# EAGLE design miniterm (EAGLE 5.10)
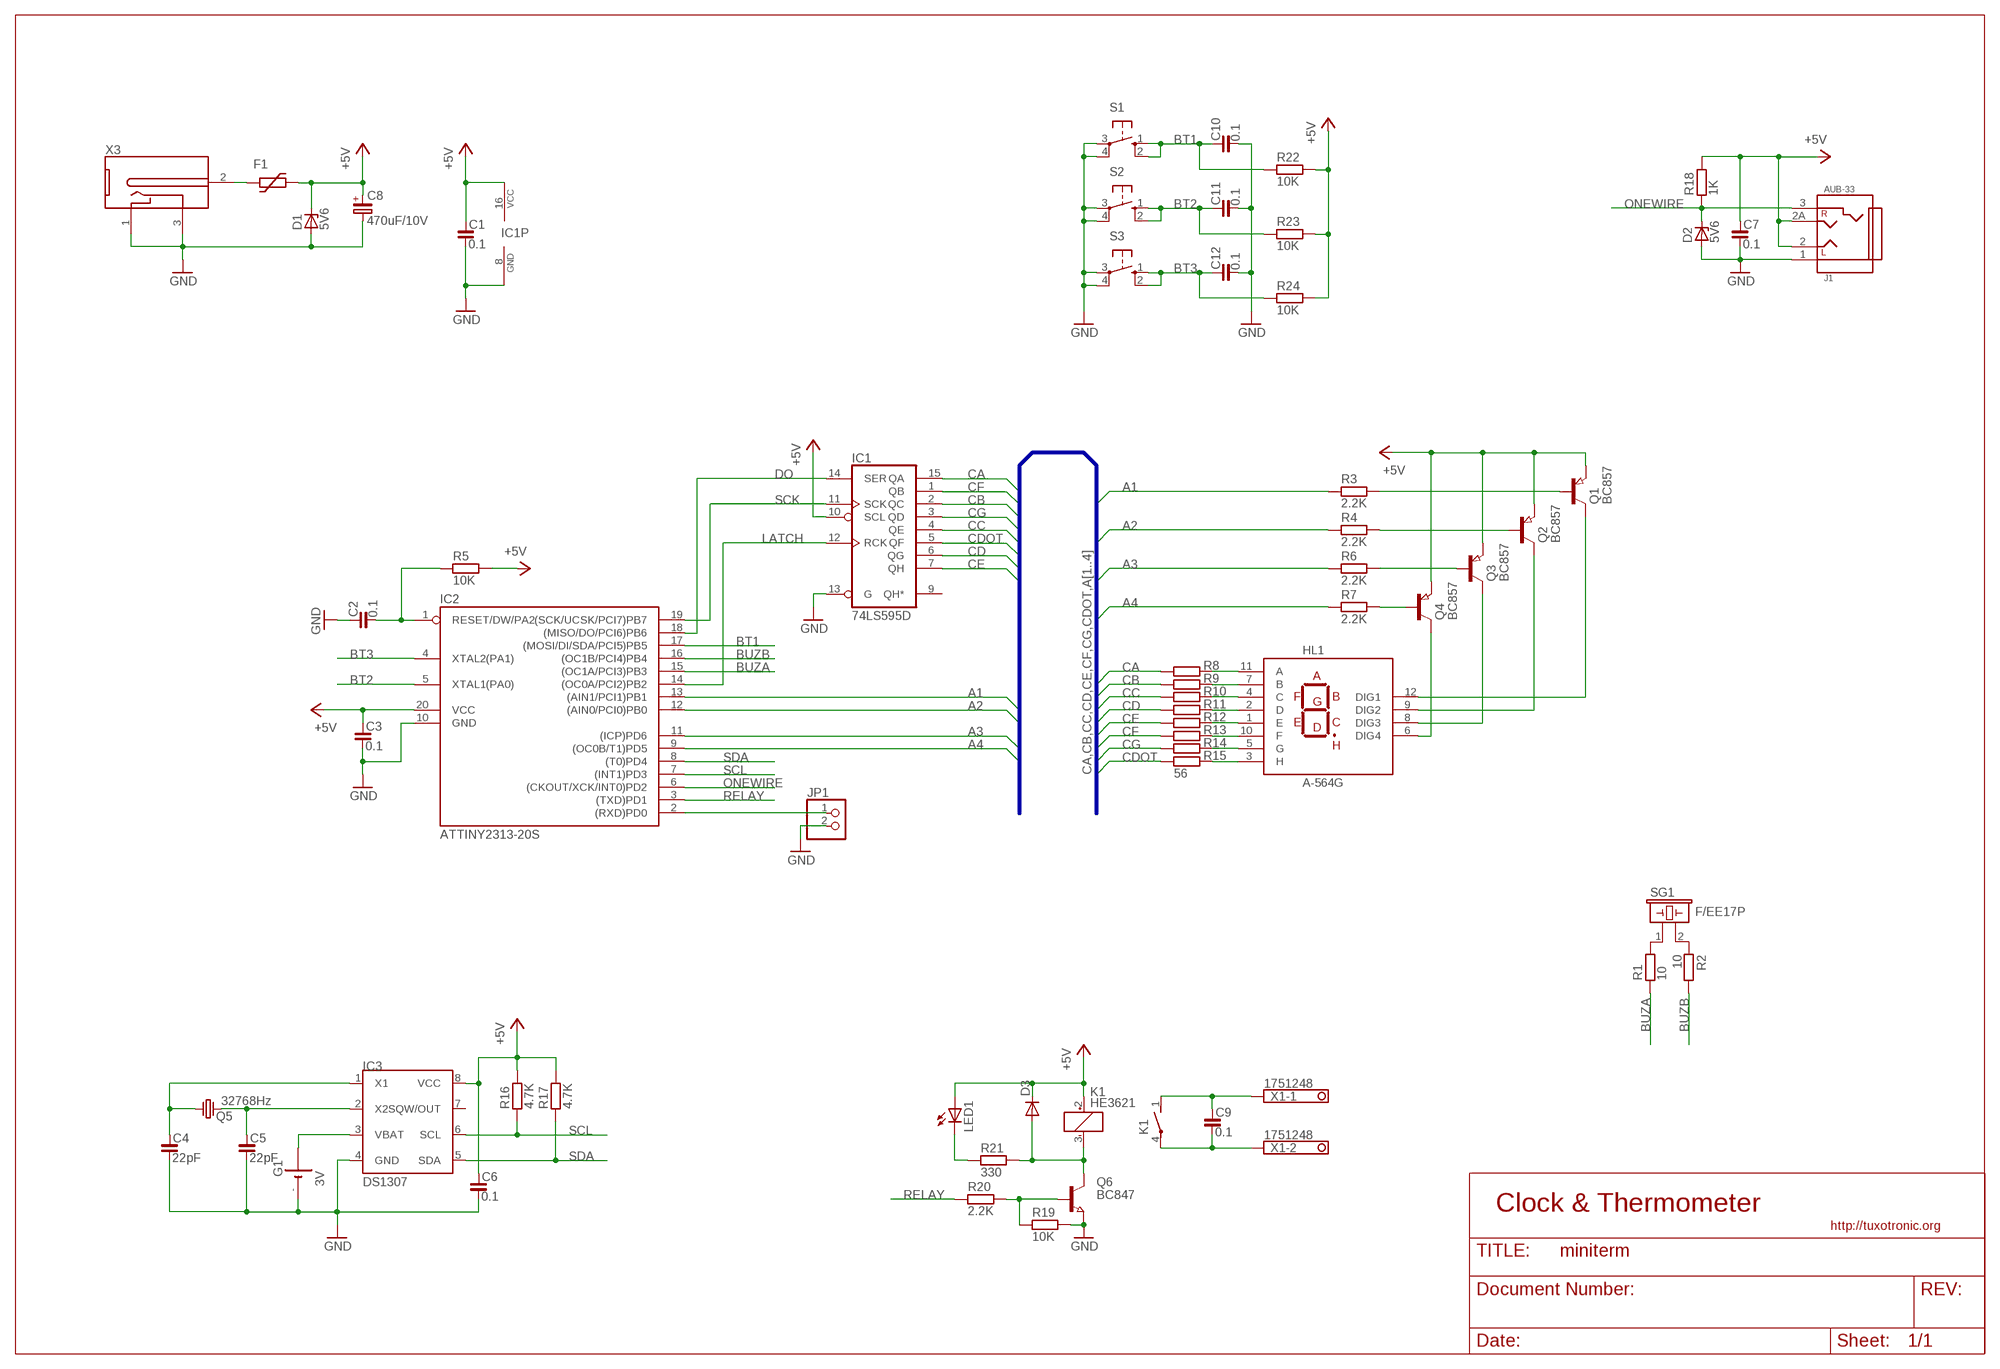
[diagram p0: schematic, sheet 1]

## Parts
C1  0.1  C_0805  [C0805]
C2  0.1  C_0805  [C0805]
C3  0.1  C_0805  [C0805]
C4  22pF  C_0805  [C0805]
C5  22pF  C_0805  [C0805]
C6  0.1  C_0805  [C0805]
C7  0.1  C_0805  [C0805]
C8  470uF/10V  CP_E-035X080  [CE-035X080]
C9  0.1  C_1206  [C1206]
C10  0.1  C_0805  [C0805]
C11  0.1  C_0805  [C0805]
C12  0.1  C_0805  [C0805]
D1  5V6  ZENER-SOD80C  [SOD80C]
D2  5V6  ZENER-SOD80C  [SOD80C]
D3  DIODE-SOD80C  [SOD80C]
F1  1812L  [1812L]
G1  3V  LI3VHOLDER  [LITHOLDER]
HL1  A-564G  [C/A-564]
IC1  74LS595D  [SO16]
IC2  ATTINY2313-20S  [SO20L]
IC3  DS1307  [SOIC-8]
J1  AUB-33  [AUB-33]
JP1  PINHD-1X2_2.54  [1X02]
K1  HE3621  [HE3621]
LED1  LED3MM  [LED3MM]
Q1  BC857  PNP-TRANSISTOR_SOT23  [SOT23]
Q2  BC857  PNP-TRANSISTOR_SOT23  [SOT23]
Q3  BC857  PNP-TRANSISTOR_SOT23  [SOT23]
Q4  BC857  PNP-TRANSISTOR_SOT23  [SOT23]
Q5  32768Hz  CRYSTAL-TC38H  [TC38H]
Q6  BC847  NPN-TRANSISTOR_SOT23  [SOT23]
R1  10  R_0805  [R0805]
R2  10  R_0805  [R0805]
R3  2.2K  R_0805  [R0805]
R4  2.2K  R_0805  [R0805]
R5  10K  R_0805  [R0805]
R6  2.2K  R_0805  [R0805]
R7  2.2K  R_0805  [R0805]
R8  56  R_0805  [R0805]
R9  56  R_0805  [R0805]
R10  56  R_0805  [R0805]
R11  56  R_0805  [R0805]
R12  56  R_0805  [R0805]
R13  56  R_0805  [R0805]
R14  56  R_0805  [R0805]
R15  56  R_0805  [R0805]
R16  4.7K  R_0805  [R0805]
R17  4.7K  R_0805  [R0805]
R18  1K  R_0805  [R0805]
R19  10K  R_0805  [R0805]
R20  2.2K  R_0805  [R0805]
R21  330  R_0805  [R0805]
R22  10K  R_0805  [R0805]
R23  10K  R_0805  [R0805]
R24  10K  R_0805  [R0805]
S1  10-XX  [B3F-10XX]
S2  10-XX  [B3F-10XX]
S3  10-XX  [B3F-10XX]
SG1  F/EE17P  [F/EE17P]
X1  1751248  [1751248]
X3  DC-2.1MM-5MM  [DC-21MM]

## Nets
+5V: C1.1 C3.1 C6.1 C7.1 C8.+ D1.C D3.C F1.P$2 IC1.10(SCL) IC1.16(VCC) IC2.20(VCC) IC3.8(VCC) J1.2 J1.2A K1.2(1:+) LED1.A Q1.2(E) Q2.2(E) Q3.2(E) Q4.2(E) R5.2 R16.2 R17.2 R18.2 R22.2 R23.2 R24.2
A1: IC2.13((AIN1/PCI1)PB1) R3.1
A2: IC2.12((AIN0/PCI0)PB0) R4.1
A3: IC2.11((ICP)PD6) R6.1
A4: IC2.9((OC0B/T1)PD5) R7.1
BT1: C10.1 IC2.17((MOSI/DI/SDA/PCI5)PB5) R22.1 S1.1(S) S1.2(S1)
BT2: C11.1 IC2.5(XTAL1(PA0)) R23.1 S2.1(S) S2.2(S1)
BT3: C12.1 IC2.4(XTAL2(PA1)) R24.1 S3.1(S) S3.2(S1)
BUZA: IC2.15((OC1A/PCI3)PB3) R1.1
BUZB: IC2.16((OC1B/PCI4)PB4) R2.2
CA: IC1.15(QA) R8.1
CB: IC1.2(QC) R9.1
CC: IC1.4(QE) R10.1
CD: IC1.6(QG) R11.1
CDOT: IC1.5(QF) R15.1
CE: IC1.7(QH) R12.1
CF: IC1.1(QB) R13.1
CG: IC1.3(QD) R14.1
DO: IC1.14(SER) IC2.18((MISO/DO/PCI6)PB6)
GND: C1.2 C2.1 C3.2 C4.2 C5.2 C6.2 C7.2 C8.- C10.2 C11.2 C12.2 D1.A D2.A G1.- IC1.8(GND) IC1.13(G) IC2.10(GND) IC3.4(GND) J1.1 JP1.2 Q6.2(E) R19.2 S1.3(P) S1.4(P1) S2.3(P) S2.4(P1) S3.3(P) S3.4(P1) X3.1 X3.3
LATCH: IC1.12(RCK) IC2.14((OC0A/PCI2)PB2)
N$2: HL1.11(A) R8.2
N$3: HL1.7(B) R9.2
N$4: HL1.4(C) R10.2
N$5: HL1.2(D) R11.2
N$6: HL1.1(E) R12.2
N$7: HL1.10(F) R13.2
N$8: HL1.5(G) R14.2
N$9: HL1.3(H) R15.2
N$10: Q1.1(B) R3.2
N$11: Q2.1(B) R4.2
N$12: Q3.1(B) R6.2
N$13: Q4.1(B) R7.2
N$14: HL1.12(DIG1) Q1.3(C)
N$15: HL1.9(DIG2) Q2.3(C)
N$16: HL1.8(DIG3) Q3.3(C)
N$17: HL1.6(DIG4) Q4.3(C)
N$18: R1.2 SG1.1
N$19: R2.1 SG1.2
N$20: C5.1 IC3.2(X2) Q5.2
N$21: C2.2 IC2.1(RESET/DW/PA2) R5.1
N$22: C4.1 IC3.1(X1) Q5.1
N$23: F1.P$1 X3.2
N$24: D3.A K1.3(1:-) Q6.3(C) R21.2
N$25: G1.+ IC3.3(VBAT)
N$26: LED1.K(C) R21.1
N$27: Q6.1(B) R19.1 R20.2
N$28: C9.1 K1.1(2:S) X1.1
N$29: C9.2 K1.4(2:P) X1.2
N$30: IC2.2((RXD)PD0) JP1.1
ONEWIRE: D2.C IC2.6((CKOUT/XCK/INT0)PD2) J1.3 R18.1
RELAY: IC2.3((TXD)PD1) R20.1
SCK: IC1.11(SCK) IC2.19((SCK/UCSK/PCI7)PB7)
SCL: IC2.7((INT1)PD3) IC3.6(SCL) R16.1
SDA: IC2.8((T0)PD4) IC3.5(SDA) R17.1
Unconnected: IC1.9(QH*) IC3.7(SQW/OUT)

## Buses
CA,CB,CC,CD,CE,CF,CG,CDOT,A[1..4]

## Notes on the sheet
- Clock & Thermometer

## Library data of the parts
C1-C7 C9-C12 = rc-master-smd:C_: NON-POLARIZED CAP
C8 = rc-master:CP_: POLARIZED CAP
D1 D2 = discrete:ZENER-: Z-Diode
D3 = discrete:DIODE-: DIODE
F1 = discrete:1812L
G1 = battery:LI3VHOLDER
HL1 = led-seg:A-564: Para Light A-564x Four digits 7seg display Common anode. 50x19 mm place. 14.22mm (560 mil) digit height CA56-21GWA compatible 2009 Draw by Ivan A-R <http://tuxotronic.org>. License CC-BY-SA 3.0 <http://creativecommons.org/licenses/by-sa/3.0/>
IC1 = 74xx-us:74*595: 8-bit SHIFT REGISTER, output latch
IC2 = avr:ATTINY2313: MICROCONTROLLER 2 Kbytes FLASH 128 bytes SRAM 128 bytes EEPROM USART USI
IC3 = dallas-1:DS1307: I2C Serial RTC w/56 bytes battery backed RAM
J1 = connectors:AUB-33
JP1 = pinhead-fixdrills:PINHD-1X2: PIN HEADER
K1 = myrelays:HE3621: RELAY reed, 1 x norm. open, grid 5.08 mm, Hamlin
LED1 = led:LED: LED OSRAM: - CHIPLED LG R971, LG N971, LY N971, LG Q971, LY Q971, LO R971, LY R971 LH N974, LH R974 LS Q976, LO Q976, LY Q976 LO Q996 - Hyper CHIPLED LW Q18S LB Q993, LB Q99A, LB R99A - SideLED LS A670, LO A670, LY A670, LG A670, LP A670 LB A673, LV A673, LT A673, LW A673 LH A674 LY A675 LS A676, LA A676, LO A676, LY A676, LW A676 LS A679, LY A679, LG A679 - Hyper Micro SIDELED® LS Y876, LA Y876, LO Y876, LY Y876 LT Y87S - SmartLED LW L88C, LW L88S LB L89C, LB L89S, LG L890 LS L89K, LO L89K, LY L89K LS L896, LA L896, LO L896, LY L896 - TOPLED LS T670, LO T670, LY T670, LG T670, LP T670 LSG T670, LSP T670, LSY T670, LOP T670, LYG T670 LG T671, LOG T671, LSG T671 LB T673, LV T673, LT T673, LW T673 LH T674 LS T676, LA T676, LO T676, LY T676, LB T676, LH T676, LSB T676, LW T676 LB T67C, LV T67C, LT T67C, LS T67K, LO T67K, LY T67K, LW E67C LS E67B, LA E67B, LO E67B, LY E67B, LB E67C, LV E67C, LT E67C LW T67C LS T679, LY T679, LG T679 LS T770, LO T770, LY T770, LG T770, LP T770 LB T773, LV T773, LT T773, LW T773 LH T774 LS E675, LA E675, LY E675, LS T675 LS T776, LA T776, LO T776, LY T776, LB T776 LHGB T686 LT T68C, LB T68C - Hyper Mini TOPLED® LB M676 - Mini TOPLED Santana® LG M470 LS M47K, LO M47K, LY M47K Source: http://www.osram.convergy.de - LUMILED® LXK2-PW12-R00, LXK2-PW12-S00, LXK2-PW14-U00, LXK2-PW14-V00 LXK2-PM12-R00, LXK2-PM12-S00, LXK2-PM14-U00 LXK2-PE12-Q00, LXK2-PE12-R00, LXK2-PE12-S00, LXK2-PE14-T00, LXK2-PE14-U00 LXK2-PB12-K00, LXK2-PB12-L00, LXK2-PB12-M00, LXK2-PB14-N00, LXK2-PB14-P00, LXK2-PB14-Q00 LXK2-PR12-L00, LXK2-PR12-M00, LXK2-PR14-Q00, LXK2-PR14-R00 LXK2-PD12-Q00, LXK2-PD12-R00, LXK2-PD12-S00 LXK2-PH12-R00, LXK2-PH12-S00 LXK2-PL12-P00, LXK2-PL12-Q00, LXK2-PL12-R00 Source: www.luxeon.com
Q1-Q4 = semicon-smd-ipc:PNP-TRANSISTOR_: PNP TRANSISTOR
Q5 = crystal:CRYSTAL-: CRYSTAL
Q6 = semicon-smd-ipc:NPN-TRANSISTOR_: NPN TRANSISTOR
R1-R24 = rc-master-smd:R_: RESISTOR
S1-S3 = buttons:10-XX: OMRON SWITCH
SG1 = buzzer:F/EE17P: BUZZER Source: Buerklin
X1 = con-phoenix-350:1751248: MKDS 1/ 2-3,5 Printklemme Nennstrom: 10 A Bemessungsspannung: 160 V Raster: 3,5 mm Polzahl: 2 Montageart: Löten Anschlussart: Schraubanschluss Anschlussrichtung vom Leiter zur Platine: 0° Source: http://eshop.phoenixcontact.com .. 1751248.pdf
X3 = power-jack:DC: 5mm x 2.1mm jack

## Board
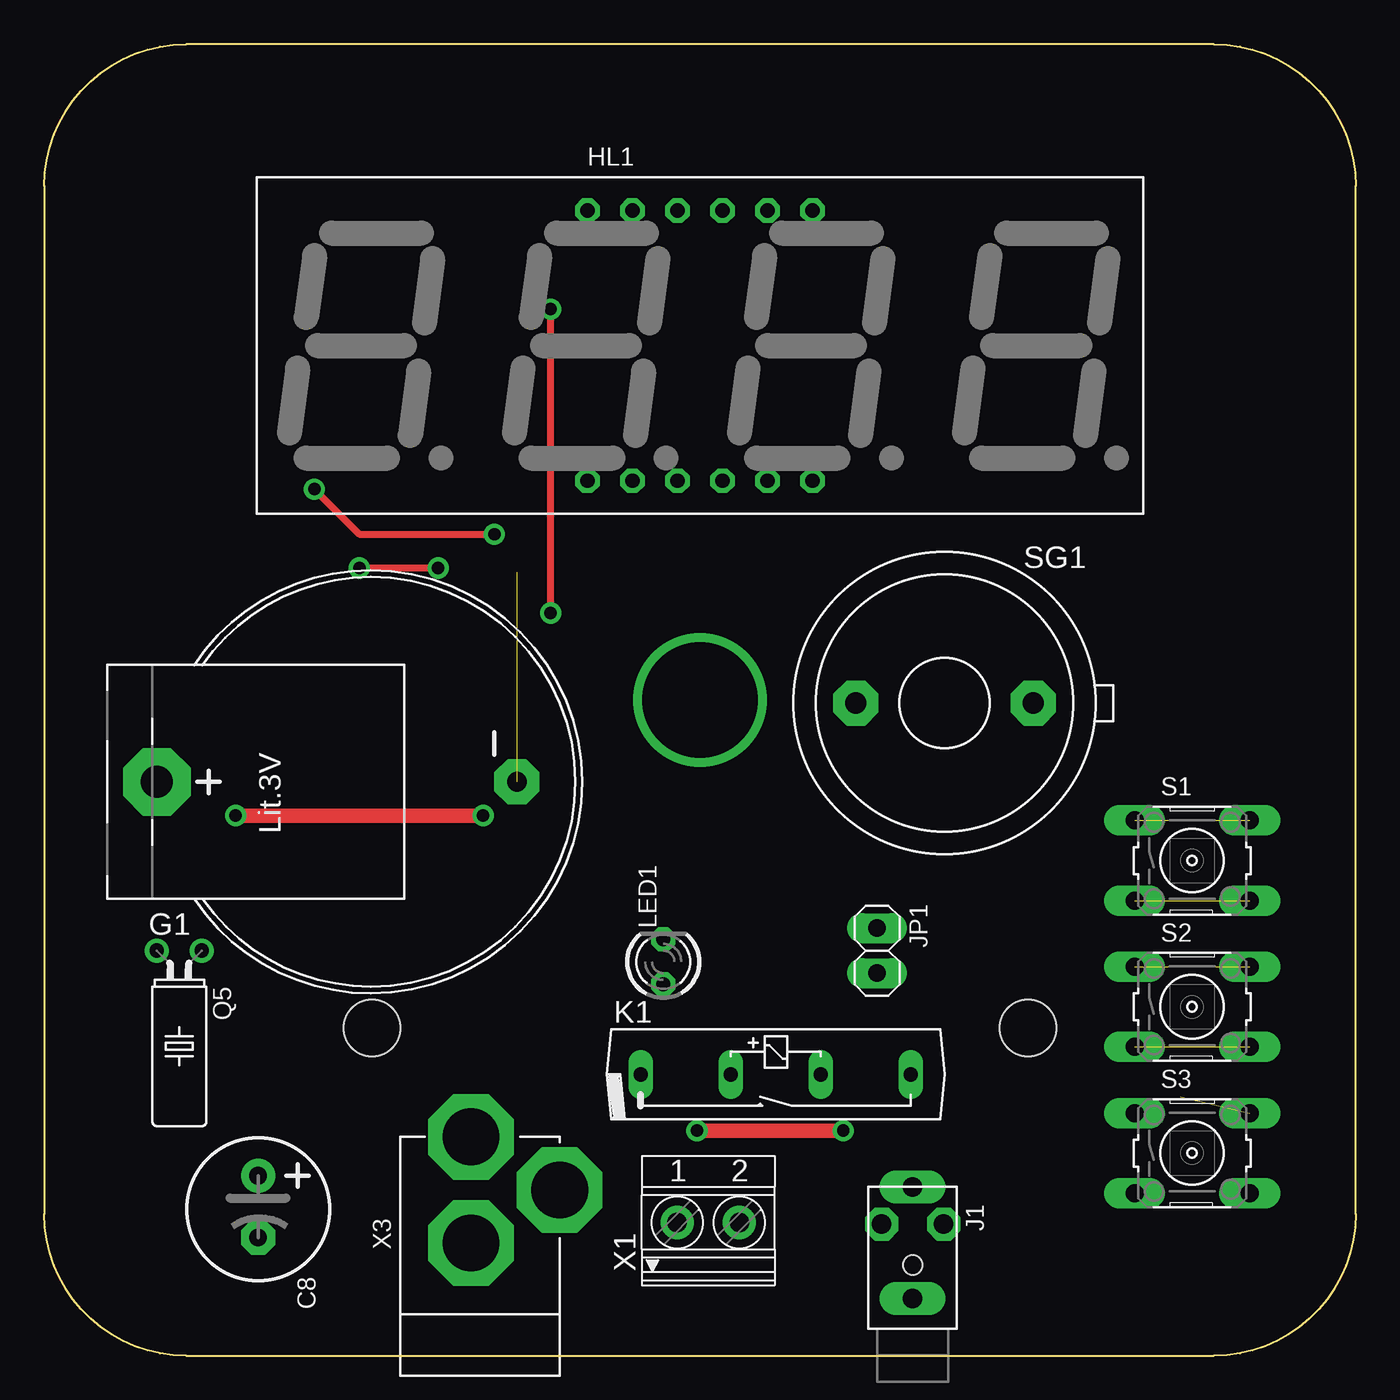
[diagram p1: board, top side]
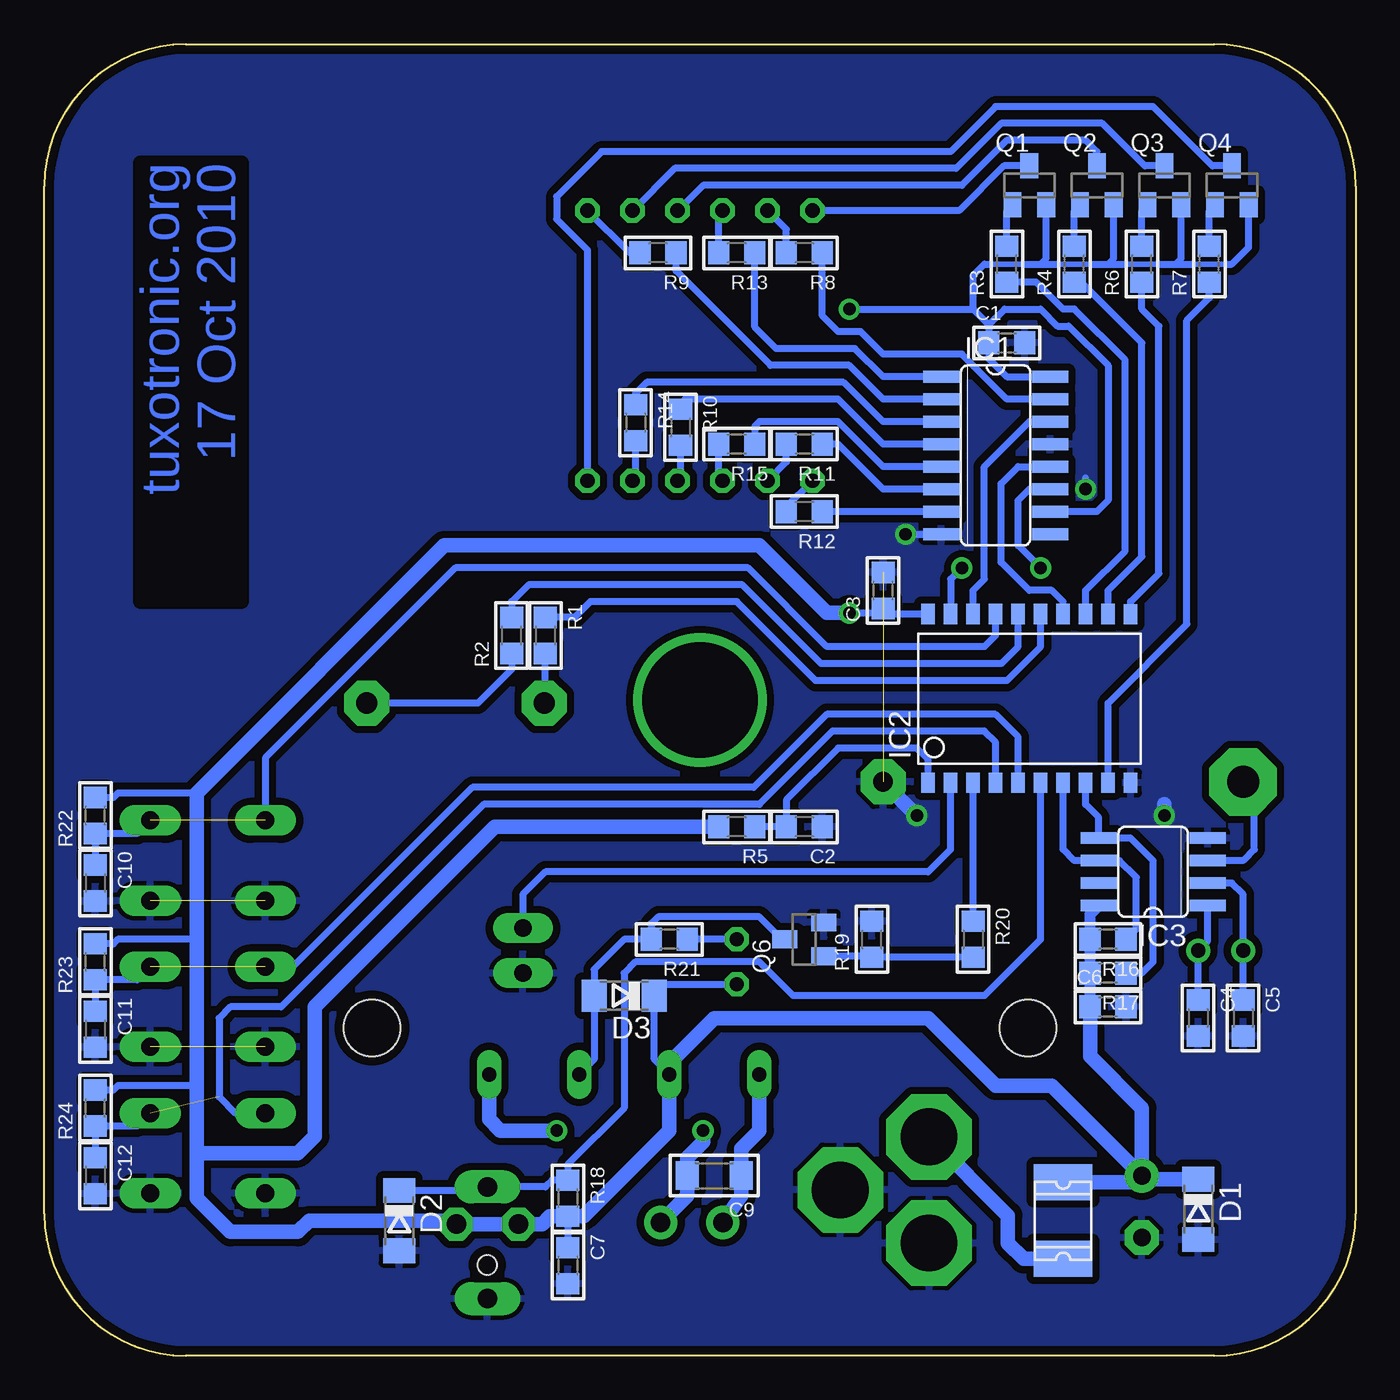
[diagram p2: board, bottom side, seen from below]

Size 74 x 74 mm. Coordinates in mm from the lower left corner, seen from the top.
Outline: 8,0 66,0 arc90 74,8 74,66 arc90 66,74 8,74 arc90 0,66 0,8 arc90 8,0
Copper layers (1*16): Top 0.035mm / dielectric 1.5mm / Bottom 0.035mm
Design rules "default *": minimum track width 10mil, minimum drill 24mil, track to track 10mil, track to pad 10mil, pad to pad 10mil, via to via 10mil, smd to smd 10mil, copper to edge 0.5mm, drill to drill 8mil, minimum pad ring 10mil, minimum via ring 8mil, stop-mask expansion 4mil, vias tented up to drill 0mil, thermal gap 10mil
Holes 3.2 mm at 18.5,18.5 55.5,18.5
bRestrict: area 62.9,42.5 to 68.6,67.3

### Footprints (pad centres in the part's own frame; a part is rotated, then mirrored left to right if it is on the bottom)
C0805 = smd 1.2 x 1.3: 1 -1.016,0; 2 1.016,0
CE-035X080 = drill 1 pad 1.93 round: + -1.905,0 | drill 1 pad 1.93 octagon: - 1.587,0
C1206 = smd 1.3 x 1.6: 1 -1.524,0; 2 1.524,0
SOD80C = smd 1.4 x 1.8: A 1.7,0; C -1.7,0
1812L = smd 2.03 x 3.3: P$1 -2.16,0; P$2 2.16,0
LITHOLDER = drill 1.803 pad 3.81 octagon: + 0,12.065 | drill 1.118 pad 2.54 octagon: - 0,-8.255
C/A-564 = drill 0.8 octagon: 1 -6.35,-7.62; 2 -3.81,-7.62; 3 -1.27,-7.62; 4 1.27,-7.62; 5 3.81,-7.62; 6 6.35,-7.62; 7 6.35,7.62; 8 3.81,7.62; 9 1.27,7.62; 10 -1.27,7.62; 11 -3.81,7.62; 12 -6.35,7.62
SO16 = smd 0.66 x 2.032: 1 -4.445,-3.073; 2 -3.175,-3.073; 3 -1.905,-3.073; 4 -0.635,-3.073; 5 0.635,-3.073; 6 1.905,-3.073; 7 3.175,-3.073; 8 4.445,-3.073; 9 4.445,3.073; 10 3.175,3.073; 11 1.905,3.073; 12 0.635,3.073; 13 -0.635,3.073; 14 -1.905,3.073; 15 -3.175,3.073; 16 -4.445,3.073
SO20L = smd 0.762 x 1.143: 1 -5.08,-5.131; 2 -3.81,-5.131; 3 -2.54,-5.131; 4 -1.27,-5.131; 5 0,-5.131; 6 1.27,-5.131; 7 2.54,-5.131; 8 3.81,-5.131; 9 5.08,-5.131; 10 6.35,-5.131; 11 6.35,4.369; 12 5.08,4.394; 13 3.81,4.394; 14 2.54,4.394; 15 1.27,4.394; 16 0,4.394; 17 -1.27,4.394; 18 -2.54,4.394; 19 -3.81,4.394; 20 -5.08,4.394
SOIC-8 = smd 2.032 x 0.66: 1 -3.073,1.27; 2 -3.073,0; 3 -3.073,-1.27; 4 -3.073,-2.54; 5 3.073,-2.54; 6 3.073,-1.27; 7 3.073,0; 8 3.073,1.27
AUB-33 = drill 1.1 long: 1 6.3,0; 3 0,0 | drill 1.1 octagon: 2 2.1,-1.75; 2A 2.1,1.75 | hole 1.1: 4.4,0
1X02 = drill 1 long: 1 -1.27,0; 2 1.27,0
HE3621 = drill 0.813 long: 1 -7.62,0; 2 -2.54,0; 3 2.54,0; 4 7.62,0
LED3MM = drill 0.8 octagon: A -1.27,0; K 1.27,0
SOT23 = smd 1 x 1.4: 1 -0.95,-1.1; 2 0.95,-1.1; 3 0,1.1
TC38H = drill 0.8 round: 1 -1.27,0; 2 1.27,0
R0805 = smd 1.2 x 1.3: 1 -1.016,0; 2 1.016,0
B3F-10XX = drill 1.016 long: 1 -3.251,2.261; 2 3.251,2.261; 3 -3.251,-2.261; 4 3.251,-2.261
F/EE17P = drill 1.194 pad 2.54 octagon: 1 -5.004,0; 2 5.004,0
1751248 = drill 1.1 pad 1.7 round: 1 -1.75,-0.1; 2 1.75,-0.1
DC-21MM = drill 3.2 pad 4.826 octagon: 1 -5.08,-3.353; 2 -0.076,-6.35; 3 -0.076,-0.356

### Placement (x,y rotation side)
C1  19.68,57.15 0 bottom
C2  31.11,29.84 180 bottom
C3  26.67,43.18 90 bottom
C4  8.89,19.05 270 bottom
C5  6.35,19.05 270 bottom
C6  13.97,19.68 0 bottom
C7  44.45,5.08 270 bottom
C8  12.06,8.26 270 top
C9  36.2,10.16 180 bottom
C10  71.12,26.67 270 bottom
C11  71.12,18.41 270 bottom
C12  71.12,10.16 270 bottom
D1  8.89,8.26 270 bottom
D2  53.98,7.62 270 bottom
D3  41.27,20.32 180 bottom
F1  16.51,7.62 90 bottom
G1  18.41,32.38 90 top
HL1  37,57 0 top
IC1  20.32,50.8 270 bottom
IC2  19.05,37.47 0 bottom
IC3  11.43,26.67 180 bottom
J1  49,9.53 270 top
JP1  46.99,22.86 270 top
K1  41.27,15.88 0 top
LED1  34.92,22.23 90 top
Q1  18.41,66.04 0 bottom
Q2  14.61,66.04 0 bottom
Q3  10.79,66.04 0 bottom
Q4  6.99,66.04 0 bottom
Q5  7.62,22.86 180 top
Q6  31.11,23.5 90 bottom
R1  45.72,40.64 270 bottom
R2  47.62,40.64 90 bottom
R3  19.68,61.59 90 bottom
R4  15.88,61.59 90 bottom
R5  34.92,29.84 180 bottom
R6  12.06,61.59 90 bottom
R7  8.26,61.59 90 bottom
R8  31.11,62.23 180 bottom
R9  39.37,62.23 180 bottom
R10  38.1,52.39 270 bottom
R11  31.11,51.44 180 bottom
R12  31.11,47.62 180 bottom
R13  34.92,62.23 180 bottom
R14  40.63,52.65 270 bottom
R15  34.92,51.44 180 bottom
R16  13.97,23.5 180 bottom
R17  13.97,21.59 180 bottom
R18  44.45,8.89 270 bottom
R19  27.3,23.5 90 bottom
R20  21.59,23.5 270 bottom
R21  38.73,23.5 180 bottom
R22  71.12,30.48 90 bottom
R23  71.12,22.23 90 bottom
R24  71.12,13.97 90 bottom
S1  64.77,27.94 0 top
S2  64.77,19.68 0 top
S3  64.77,11.43 0 top
SG1  50.8,36.83 0 top
X1  37.47,7.62 0 top
X3  24,6 180 top

### Tracks (layer width: path | path; a pad name or v marks a point on that pad's centre or on a via)
+5V  (via drill 0.7)
  Top 0.406: v28.57,41.91 v28.57,59.05
  Bottom 0.305: 9.21,61.59 7.3,61.59 | 13.02,61.59 11.11,61.59 | 16.83,61.59 14.92,61.59 | 20.64,61.59 18.73,61.59
  Bottom 0.406: Q4.2 6.04,62.55 6.99,61.59 7.3,61.59 | IC1.16 19.68,55.24 20.7,56.26 C1.1 20.7,58.17 | Q3.2 9.85,61.91 10.16,61.59 | Q2.2 13.65,61.91 13.97,61.59 | Q1.2 17.46,61.91 17.78,61.59 | 10.16,61.59 9.21,61.59 | 11.11,61.59 10.16,61.59 | 13.97,61.59 13.02,61.59 | 14.92,61.59 13.97,61.59 | 17.78,61.59 16.83,61.59 | 18.73,61.59 17.78,61.59 | 20.64,61.59 20.95,61.59 21.59,60.96 21.59,59.05 | 21.59,59.05 20.7,58.17 | v28.57,59.05 21.59,59.05 | v28.57,41.91 26.92,41.91 C3.1 26.36,41.86 IC2.20 | R18.2 C7.1 | K1.2 39.58,16.71 D3.C 38.94,20.95 LED1.A | R24.2 70.1,14.99 69.85,15.24 65.41,15.24 | R23.2 70.1,23.24 69.85,23.5 65.41,23.5 | R22.2 70.1,31.5 69.85,31.75 65.41,31.75 | IC1.10 14.61,47.62 13.97,48.26 13.97,55.88 16.19,58.1 16.83,58.1 17.78,59.05 19.81,59.05 20.7,58.17
  Bottom 0.61: IC3.8 14.99,24.92 R16.2 R17.2 C6.1
  Bottom 0.813: v28.57,41.91 29.84,41.91 33.66,45.72 51.44,45.72 65.41,31.75 65.41,23.5 65.41,15.24 65.41,11.43 | 65.41,11.43 65.41,8.89 63.5,6.99 59.69,6.99 59.05,7.62 50.95,7.62 J1.2A J1.2 45.91,7.42 45.47,7.87 R18.2 43.56,7.87 38.73,12.7 K1.2 38.73,16.51 36.2,19.05 24.13,19.05 20.32,15.24 17.14,15.24 C8.+ | D1.C 11.86,9.96 C8.+ | F1.P$2 12.45,9.78 C8.+ | R5.2 48.58,29.84 58.74,19.68 58.74,12.38 59.69,11.43 65.41,11.43 | C6.1 14.99,16.89 12.06,13.97 C8.+
A1
  Bottom 0.406: IC2.13 15.24,43.18 13.02,45.4 13.02,56.2 15.88,59.05 16.51,59.05 18.03,60.58 R3.1
A2
  Bottom 0.406: IC2.12 13.97,43.18 12.06,45.09 12.06,57.15 15.49,60.58 R4.1
A3
  Bottom 0.406: IC2.11 12.7,42.55 11.11,44.13 11.11,58.1 12.06,59.05 R6.1
A4
  Bottom 0.406: IC2.9 13.97,36.83 9.53,41.27 9.53,58.42 8.26,59.69 R7.1
BT1  (1 unrouted)
  Bottom 0.406: S1.1 61.52,33.73 50.8,44.45 34.29,44.45 29.84,40.01 20.95,40.01 20.32,40.64 IC2.17 | C10.1 R22.1 68.76,29.46 S1.2
BT2  (1 unrouted)
  Bottom 0.406: IC2.5 19.05,34.92 20.32,36.2 29.84,36.2 33.97,32.07 49.85,32.07 59.97,21.95 S2.1 | C11.1 R23.1 68.76,21.21 S2.2
BT3  (1 unrouted)
  Bottom 0.406: IC2.4 20.32,34.61 20.95,35.24 29.53,35.24 33.66,31.11 49.21,31.11 60.64,19.68 63.5,19.68 64.14,19.05 64.14,14.61 63.22,13.69 S3.1 | C12.1 R24.1 68.76,12.95 S3.2
BUZA
  Bottom 0.406: IC2.15 17.78,40.01 19.68,38.1 30.48,38.1 34.92,42.55 43.18,42.55 44.07,41.66 R1.1
BUZB
  Bottom 0.406: IC2.16 19.05,40.01 20,39.05 30.16,39.05 34.61,43.5 46.67,43.5 47.62,42.55 R2.2
CA
  Bottom 0.406: IC1.15 19.68,53.98 22.23,56.52 26.67,56.52 27.94,57.78 29.21,57.78 30.1,58.67 R8.1
CB
  Bottom 0.406: IC1.2 26.67,53.98 28.57,55.88 33.02,55.88 38.35,61.21 R9.1
CC
  Bottom 0.406: IC1.4 26.67,51.44 29.21,53.98 37.85,53.98 R10.1
CD
  Bottom 0.406: R11.1 29.21,51.44 26.67,48.9 IC1.6
CDOT
  Bottom 0.406: R15.1 33.91,52.45 33.66,52.7 29.21,52.7 26.67,50.16 IC1.5
CE
  Bottom 0.406: IC1.7 R12.1
CF
  Bottom 0.406: IC1.1 26.67,55.24 28.26,56.83 32.7,56.83 33.91,58.04 R13.1
CG
  Bottom 0.406: IC1.3 26.67,52.7 28.89,54.93 40.01,54.93 40.63,54.3 R14.1
DO
  Bottom 0.406: IC1.14 18.41,52.7 20.95,50.16 20.95,43.81 21.59,43.18 IC2.18
GND  (via drill 0.7)  (3 unrouted)
  Top 0.406: v15.24,48.9 17.78,46.35 v25.4,46.35
  Top 0.813: v10.79,30.48 v24.77,30.48
  Bottom 0.406: v25.4,46.35 IC1.8 | v15.24,48.9 15.24,49.53
  Bottom 0.813: v24.77,30.48 G1.- | v10.79,30.48 10.79,31.11
  pour Bottom (isolate 0.406): -0.64,74.3 74.3,74.3 74.3,-0.64 -0.64,-0.64
LATCH
  Bottom 0.406: IC1.12 19.05,50.16 20,49.21 20,44.77 18.41,43.18 17.14,43.18 16.51,42.55 IC2.14
N$1  (via drill 6.5)
  other vias: 37,37
N$2
  Bottom 0.406: R8.2 32.13,63.56 HL1.11
N$3
  Bottom 0.406: R9.2 40.96,62.23 HL1.7
N$4
  Bottom 0.406: R10.2 38.1,49.55 HL1.4
N$5
  Bottom 0.406: R11.2 32.13,50.44 HL1.2
N$6
  Bottom 0.406: R12.2 32.13,47.9 HL1.1
N$7
  Bottom 0.406: R13.2 35.94,64.41 HL1.10
N$8
  Bottom 0.406: R14.2 40.63,49.56 HL1.5
N$9
  Bottom 0.406: R15.2 35.94,49.59 HL1.3
N$10
  Bottom 0.406: R3.2 19.68,64.62 Q1.1
N$11
  Bottom 0.406: R4.2 15.88,64.62 Q2.1
N$12
  Bottom 0.406: R6.2 12.06,64.62 Q3.1
N$13
  Bottom 0.406: R7.2 8.26,64.62 Q4.1
N$14
  Bottom 0.406: HL1.12 22.38,64.62 19.86,67.14 Q1.3
N$15
  Bottom 0.406: HL1.9 38.25,64.62 36.83,66.04 22.23,66.04 19.68,68.58 15.24,68.58 14.61,67.94 Q2.3
N$16
  Bottom 0.406: HL1.8 40.79,64.62 38.42,66.99 22.54,66.99 20,69.53 14.29,69.53 11.89,67.14 Q3.3
N$17
  Bottom 0.406: HL1.6 43.35,62.4 45.09,64.14 45.09,65.41 42.55,67.94 22.86,67.94 20.32,70.48 11.43,70.48 8.09,67.14 Q4.3
N$18
  Bottom 0.406: R1.2 45.72,36.91 SG1.1
N$19
  Bottom 0.406: SG1.2 49.53,36.83 47.62,38.73 R2.1
N$20
  Bottom 0.406: IC3.2 6.99,26.67 6.35,26.04 Q5.2 C5.1
N$21
  Bottom 0.406: IC2.1 24.13,33.66 24.77,34.29 29.21,34.29 32.13,31.37 C2.2 R5.1
N$22
  Bottom 0.406: IC3.1 8.36,23.39 Q5.1 C4.1
N$23
  Bottom 0.813: F1.P$1 18.74,5.46 19.63,6.36 19.63,7.91 X3.2
N$24
  Bottom 0.406: K1.3 42.98,16.71 D3.A 42.98,21.8 41.27,23.5 R21.2 39.75,24.38 39.37,24.77 33.66,24.77 32.38,23.5 Q6.3
N$25
  Bottom 0.406: IC3.3 6.35,27.94 5.71,28.57 5.71,31.75 G1.+
N$26
  Bottom 0.406: LED1.K R21.1
N$27
  Bottom 0.406: R20.2 R19.1 27.37,22.55 Q6.1
N$28
  Bottom 0.813: X1.1 34.67,9.02 C9.1 34.67,11.68 33.66,12.7 K1.1
N$29  (via drill 0.7)
  Top 0.813: v36.83,12.7 v45.09,12.7
  Bottom 0.813: K1.4 48.9,13.34 48.26,12.7 v45.09,12.7 | v36.83,12.7 36.83,12.06 37.72,11.18 C9.2 37.72,9.02 X1.2
N$30
  Bottom 0.406: JP1.1 46.99,26.04 45.72,27.3 24.13,27.3 22.86,28.57 IC2.2
ONEWIRE
  Bottom 0.406: D2.C 49.2,9.32 J1.3 45.72,9.53 45.34,9.91 R18.1 44.45,10.79 41.27,13.97 41.27,21.59 40.64,22.23 33.66,22.23 31.75,20.32 20.95,20.32 17.78,23.5 IC2.6
RELAY
  Bottom 0.406: R20.1 IC2.3
SCK  (via drill 0.7)
  Top 0.406: v17.78,44.45 v22.23,44.45
  Bottom 0.406: IC2.19 22.86,43.81 v22.23,44.45 | IC1.11 18.41,48.9 19.05,48.26 19.05,45.72 v17.78,44.45
SCL
  Bottom 0.406: R16.1 12.38,24.07 12.38,26.99 13.34,27.94 IC3.6 15.88,27.94 16.51,28.57 IC2.7
SDA
  Bottom 0.406: R17.1 12.06,21.59 11.43,22.23 11.43,27.94 12.7,29.21 IC3.5 14.5,30.38 15.24,31.11 IC2.8

### Text on the board
Bottom: 17 Oct 2010 | tuxotronic.org